# Altium schematic sheet SG_Amplifiers_LTC2053.SchDoc
size A
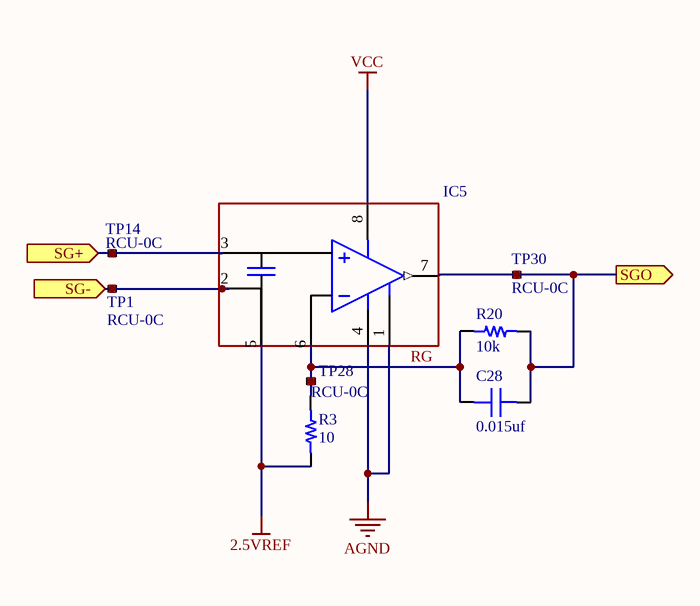
[diagram p0: SG_Amplifiers_LTC2053.SchDoc]

## Parts
C28  value 0.015uf  [CAP 0603/1608]  (hidden comment: Capacitor MLCC 0.015uf 25V CAP 0603/1608)
IC5  (no value)  [MSOP-8]
R3  value 10  [RES 0603/1608]  (hidden comment: Resistor 10 0603 1/10W 1%)
R20  value 10k  [RES 0603/1608]  (hidden comment: Resistor 10k 0603 1/10W 1%)
TP1  RCU-0C  [RCU-0C]
TP14  RCU-0C  [RCU-0C]
TP28  RCU-0C  [RCU-0C]
TP30  RCU-0C  [RCU-0C]

## Ports
SG+ (in), SG- (in), SGO (out)

## Nets
2.5VREF: IC5.5(REF) R3.1
AGND: IC5.1 IC5.4(V-)
VCC: IC5.8(V+)
RG: C28.1 IC5.6(RG) R3.2 R20.1 TP28.1
SG+: IC5.3(+IN) TP14.1 ; port SG+
SG-: IC5.2(-IN) TP1.1 ; port SG-
SGO: C28.2 IC5.7(OUT) R20.2 TP30.1 ; port SGO

## Library data of the parts
C28 = 578: Manufacturer_id: 1; idCapacitor: 578; Name: Cap_0.015uf_25V_CAP 0603/1608; Dielectric: Ceramic; Created_By: Nick Mah; Drawer_id: 1; Voltage_Rating: 25V; Package: CAP 0603/1608; Created_Date: 10/20/2018
IC5 = 2: Manufacturer_id: 1; MfrPartNo: LTC2053; idOp_Amp: 2; Name: Instrumentation Amplifier; Amplifier_Type: Instrumentation; Supply_Voltage: 2.7V to ±5.5V; Created_By: Angel Delgado; Drawer_id: 1; Num_Circuits: 1; Package: MSOP8; Link: https://www.digikey.com/product-detail/en/linear-technology-analog-devices/LTC2053CMS8-TRPBF/LTC2053CMS8-TRPBFCT-ND/5892339
R3 = 241: Manufacturer_id: 1; idResistor: 241; Name: Res_10_0603_1/10W_1%; Created_By: Nick Mah; Supplier 1: Digi-Key; Drawer_id: 1; Tolerance: 1%; Power: 1/10W; Package: 0603; ComponentLink1Description: Datasheet; Created_Date: 2018-10-20
R20 = 313: Manufacturer_id: 1; idResistor: 313; Name: Res_10k_0603_1/10W_1%; Created_By: Nick Mah; Supplier 1: Digi-Key; Drawer_id: 1; Tolerance: 1%; Power: 1/10W; Package: 0603; ComponentLink1Description: Datasheet; Created_Date: 2018-10-20
TP1 TP14 TP28 TP30 = 14: Test point; Manufacturer_id: 1; idConn: 14; Value: CONN; Created_By: Graydon; Updated_By: Null; Drawer_id: 1; Name: RCU-0C; Num_Contacts: 1; Num_Rows: 1; Package: RCU-0C; MfrPartNo: RCU-0C; Link: https://www.digikey.com/product-detail/en/te-connectivity-amp-connectors/RCU-0C/A106145CT-ND/3477802; ComponentLink1Description: Null; ComponentLink1URL: Null; Supplier1: None; Supplier1PartNo: None; Created_Date: 11/10/2018